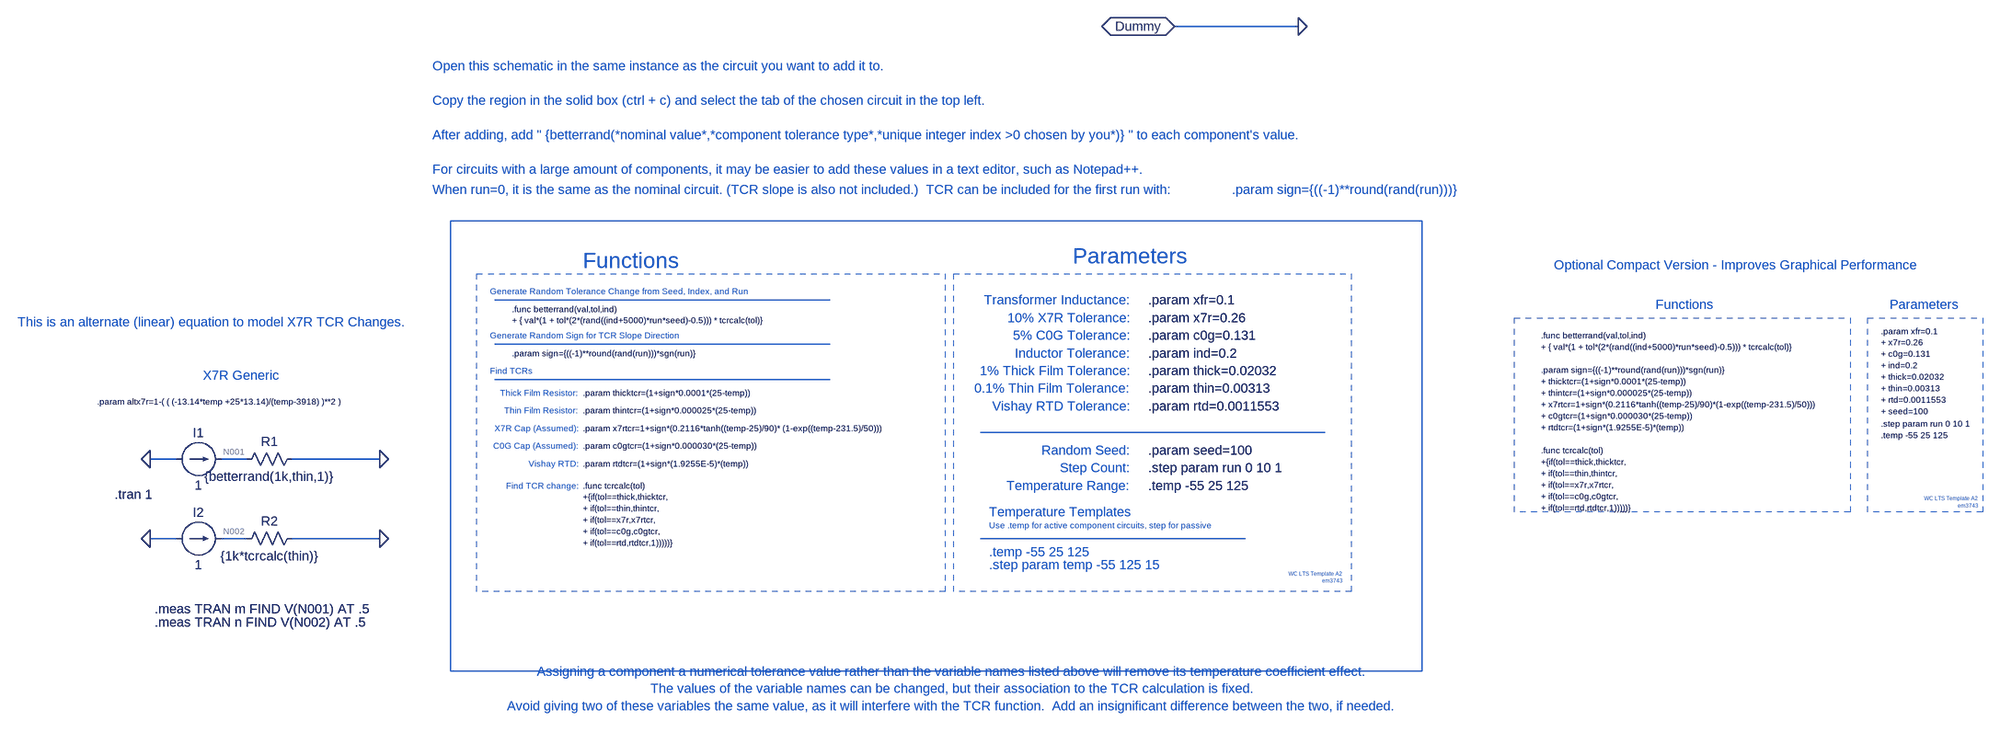
[diagram p0: schematic WCSpiceBlock_A2.asc]
WCSpiceBlock_A2.asc, the LTspice schematic file:
Version 4
SHEET 1 3364 776
WIRE 1296 -640 1072 -640
WIRE -736 144 -784 144
WIRE -608 144 -656 144
WIRE -368 144 -528 144
WIRE -736 288 -784 288
WIRE -608 288 -656 288
WIRE -368 288 -528 288
FLAG -784 144 0
FLAG -368 144 0
FLAG -784 288 0
FLAG -368 288 0
FLAG 1072 -640 Dummy
IOPIN 1072 -640 BiDir
FLAG 1296 -640 0
SYMBOL res -512 128 R90
WINDOW 0 0 56 VBottom 2
WINDOW 3 32 56 VTop 2
SYMATTR InstName R1
SYMATTR Value {betterrand(1k,thin,1)}
SYMBOL current -736 144 R270
WINDOW 0 32 40 VTop 2
WINDOW 3 -32 40 VBottom 2
WINDOW 123 0 0 Left 0
WINDOW 39 0 0 Left 0
SYMATTR InstName I1
SYMATTR Value 1
SYMBOL res -512 272 R90
WINDOW 0 0 56 VBottom 2
WINDOW 3 32 56 VTop 2
SYMATTR InstName R2
SYMATTR Value {1k*tcrcalc(thin)}
SYMBOL current -736 288 R270
WINDOW 0 32 40 VTop 2
WINDOW 3 -32 40 VBottom 2
WINDOW 123 0 0 Left 0
WINDOW 39 0 0 Left 0
SYMATTR InstName I2
SYMATTR Value 1
TEXT -848 208 Left 2 !.tran 1
TEXT -776 416 Left 2 !.meas TRAN m FIND V(N001) AT .5
TEXT -776 440 Left 2 !.meas TRAN n FIND V(N002) AT .5
TEXT 1024 -112 Left 2 !.param x7r=0.26
TEXT 1024 -16 Left 2 !.param thick=0.02032
TEXT 1024 16 Left 2 !.param thin=0.00313
TEXT -128 -128 Left 1 !.func betterrand(val,tol,ind)\n+ { val*(1 + tol*(2*(rand((ind+5000)*run*seed)-0.5))) * tcrcalc(tol)}
TEXT 1024 -144 Left 2 !.param xfr=0.1
TEXT 1024 -48 Left 2 !.param ind=0.2
TEXT 0 192 Left 1 !.func tcrcalc(tol)\n+{if(tol==thick,thicktcr, \n+ if(tol==thin,thintcr,\n+ if(tol==x7r,x7rtcr,\n+ if(tol==c0g,c0gtcr,\n+ if(tol==rtd,rtdtcr,1)))))}
TEXT 0 24 Left 1 !.param thicktcr=(1+sign*0.0001*(25-temp))
TEXT 0 56 Left 1 !.param thintcr=(1+sign*0.000025*(25-temp))
TEXT -128 -48 Left 1 !.param sign={((-1)**round(rand(run)))*sgn(run)}
TEXT 1024 160 Left 2 !.step param run 0 10 1
TEXT 1024 192 Left 2 !.temp -55 25 125
TEXT 736 264 Left 1 ;Use .temp for active component circuits, step for passive
TEXT 0 88 Left 1 !.param x7rtcr=1+sign*(0.2116*tanh((temp-25)/90)* (1-exp((temp-231.5)/50)))
TEXT -8 24 Right 1 ;Thick Film Resistor:
TEXT -8 56 Right 1 ;Thin Film Resistor:
TEXT -8 88 Right 1 ;X7R Cap (Assumed):
TEXT 992 -144 Right 2 ;Transformer Inductance:
TEXT 992 -112 Right 2 ;10% X7R Tolerance:
TEXT 992 -48 Right 2 ;Inductor Tolerance:
TEXT 992 -16 Right 2 ;1% Thick Film Tolerance:
TEXT 992 16 Right 2 ;0.1% Thin Film Tolerance:
TEXT 1024 128 Left 2 !.param seed=100
TEXT -8 192 Right 1 ;Find TCR change:
TEXT -168 -160 Left 1 ;Generate Random Tolerance Change from Seed, Index, and Run
TEXT 992 128 Right 2 ;Random Seed:
TEXT 736 240 Left 2 ;Temperature Templates
TEXT 736 312 Left 2 ;.temp -55 25 125
TEXT 736 336 Left 2 ;.step param temp -55 125 15
TEXT -168 -80 Left 1 ;Generate Random Sign for TCR Slope Direction
TEXT 992 192 Right 2 ;Temperature Range:
TEXT 992 160 Right 2 ;Step Count:
TEXT -168 -16 Left 1 ;Find TCRs
TEXT 888 -224 Left 4 ;Parameters
TEXT 0 -216 Left 4 ;Functions
TEXT 0 120 Left 1 !.param c0gtcr=(1+sign*0.000030*(25-temp))
TEXT -8 120 Right 1 ;C0G Cap (Assumed):
TEXT 1024 -80 Left 2 !.param c0g=0.131
TEXT 992 -80 Right 2 ;5% C0G Tolerance:
TEXT -688 -8 Left 2 ;X7R Generic
TEXT -880 40 Left 1 !.param altx7r=1-( ( (-13.14*temp +25*13.14)/(temp-3918) )**2 )
TEXT -1024 -104 Left 2 ;This is an alternate (linear) equation to model X7R TCR Changes.
TEXT -272 -568 Left 2 ;Open this schematic in the same instance as the circuit you want to add it to.\n \nCopy the region in the solid box (ctrl + c) and select the tab of the chosen circuit in the top left.\n \nAfter adding, add " {betterrand(*nominal value*,*component tolerance type*,*unique integer index >0 chosen by you*)} " to each component's value.\n \nFor circuits with a large amount of components, it may be easier to add these values in a text editor, such as Notepad++.
TEXT -8 152 Right 1 ;Vishay RTD:
TEXT 1024 48 Left 2 !.param rtd=0.0011553
TEXT 992 48 Right 2 ;Vishay RTD Tolerance:
TEXT 0 152 Left 1 !.param rtdtcr=(1+sign*(1.9255E-5)*(temp))
TEXT -272 -344 Left 2 ;When run=0, it is the same as the nominal circuit. (TCR slope is also not included.)  TCR can be included for the first run with:
TEXT 1176 -344 Left 2 ;.param sign={((-1)**round(rand(run)))}
TEXT 1824 -80 Left 1 !.func betterrand(val,tol,ind)\n+ { val*(1 + tol*(2*(rand((ind+5000)*run*seed)-0.5))) * tcrcalc(tol)}\n \n.param sign={((-1)**round(rand(run)))*sgn(run)}\n+ thicktcr=(1+sign*0.0001*(25-temp))\n+ thintcr=(1+sign*0.000025*(25-temp))\n+ x7rtcr=1+sign*(0.2116*tanh((temp-25)/90)*(1-exp((temp-231.5)/50)))\n+ c0gtcr=(1+sign*0.000030*(25-temp))\n+ rtdtcr=(1+sign*(1.9255E-5)*(temp))\n \n.func tcrcalc(tol)\n+{if(tol==thick,thicktcr, \n+ if(tol==thin,thintcr,\n+ if(tol==x7r,x7rtcr,\n+ if(tol==c0g,c0gtcr,\n+ if(tol==rtd,rtdtcr,1)))))}
TEXT 2440 -88 Left 1 !.param xfr=0.1\n+ x7r=0.26\n+ c0g=0.131\n+ ind=0.2\n+ thick=0.02032\n+ thin=0.00313\n+ rtd=0.0011553\n+ seed=100
TEXT 2440 80 Left 1 !.step param run 0 10 1\n.temp -55 25 125
TEXT 2456 -136 Left 2 ;Parameters
TEXT 2032 -136 Left 2 ;Functions
TEXT 1848 -208 Left 2 ;Optional Compact Version - Improves Graphical Performance
TEXT 672 560 Center 2 ;Assigning a component a numerical tolerance value rather than the variable names listed above will remove its temperature coefficient effect.\nThe values of the variable names can be changed, but their association to the TCR calculation is fixed.\nAvoid giving two of these variables the same value, as it will interfere with the TCR function.  Add an insignificant difference between the two, if needed.
TEXT 2616 216 Right 0 ;WC LTS Template A2\nem3743
TEXT 1376 352 Right 0 ;WC LTS Template A2\nem3743
LINE Normal 1344 96 720 96
LINE Normal 1200 288 720 288
LINE Normal 448 -144 -160 -144
LINE Normal 448 -64 -160 -64
LINE Normal 448 0 -160 0
RECTANGLE Normal 656 384 -192 -192 2
RECTANGLE Normal 1392 384 672 -192 2
RECTANGLE Normal 1520 528 -240 -288
RECTANGLE Normal 2384 240 1776 -112 2
RECTANGLE Normal 2624 240 2416 -112 2

The netlist it stands for:
* WCSpiceBlock_A2.asc
R1 0 N001 {betterrand(1k,thin,1)}
I1 0 N001 1
R2 0 N002 {1k*tcrcalc(thin)}
I2 0 N002 1
.tran 1
.meas TRAN m FIND V(N001) AT .5
.meas TRAN n FIND V(N002) AT .5
.param x7r=0.26
.param thick=0.02032
.param thin=0.00313
.func betterrand(val,tol,ind)
+ { val*(1 + tol*(2*(rand((ind+5000)*run*seed)-0.5))) * tcrcalc(tol)}
.param xfr=0.1
.param ind=0.2
.func tcrcalc(tol)
+{if(tol==thick,thicktcr,
+ if(tol==thin,thintcr,
+ if(tol==x7r,x7rtcr,
+ if(tol==c0g,c0gtcr,
+ if(tol==rtd,rtdtcr,1)))))}
.param thicktcr=(1+sign*0.0001*(25-temp))
.param thintcr=(1+sign*0.000025*(25-temp))
.param sign={((-1)**round(rand(run)))*sgn(run)}
.step param run 0 10 1
.temp -55 25 125
* Use .temp for active component circuits, step for passive
.param x7rtcr=1+sign*(0.2116*tanh((temp-25)/90)* (1-exp((temp-231.5)/50)))
* Thick Film Resistor:
* Thin Film Resistor:
* X7R Cap (Assumed):
* Transformer Inductance:
* 10% X7R Tolerance:
* Inductor Tolerance:
* 1% Thick Film Tolerance:
* 0.1% Thin Film Tolerance:
.param seed=100
* Find TCR change:
* Generate Random Tolerance Change from Seed, Index, and Run
* Random Seed:
* Temperature Templates
* .temp -55 25 125
* .step param temp -55 125 15
* Generate Random Sign for TCR Slope Direction
* Temperature Range:
* Step Count:
* Find TCRs
* Parameters
* Functions
.param c0gtcr=(1+sign*0.000030*(25-temp))
* C0G Cap (Assumed):
.param c0g=0.131
* 5% C0G Tolerance:
* X7R Generic
.param altx7r=1-( ( (-13.14*temp +25*13.14)/(temp-3918) )**2 )
* This is an alternate (linear) equation to model X7R TCR Changes.
* Open this schematic in the same instance as the circuit you want to add it to.
* Copy the region in the solid box (ctrl + c) and select the tab of the chosen circuit in the top left.
* After adding, add " {betterrand(*nominal value*,*component tolerance type*,*unique integer index >0 chosen by you*)} " to each component's value.
* For circuits with a large amount of components, it may be easier to add these values in a text editor, such as Notepad++.
* Vishay RTD:
.param rtd=0.0011553
* Vishay RTD Tolerance:
.param rtdtcr=(1+sign*(1.9255E-5)*(temp))
* When run=0, it is the same as the nominal circuit. (TCR slope is also not included.)  TCR can be included for the first run with:
* .param sign={((-1)**round(rand(run)))}
.func betterrand(val,tol,ind)
+ { val*(1 + tol*(2*(rand((ind+5000)*run*seed)-0.5))) * tcrcalc(tol)}
.param sign={((-1)**round(rand(run)))*sgn(run)}
+ thicktcr=(1+sign*0.0001*(25-temp))
+ thintcr=(1+sign*0.000025*(25-temp))
+ x7rtcr=1+sign*(0.2116*tanh((temp-25)/90)*(1-exp((temp-231.5)/50)))
+ c0gtcr=(1+sign*0.000030*(25-temp))
+ rtdtcr=(1+sign*(1.9255E-5)*(temp))
.func tcrcalc(tol)
+{if(tol==thick,thicktcr,
+ if(tol==thin,thintcr,
+ if(tol==x7r,x7rtcr,
+ if(tol==c0g,c0gtcr,
+ if(tol==rtd,rtdtcr,1)))))}
.param xfr=0.1
+ x7r=0.26
+ c0g=0.131
+ ind=0.2
+ thick=0.02032
+ thin=0.00313
+ rtd=0.0011553
+ seed=100
.step param run 0 10 1
.temp -55 25 125
* Parameters
* Functions
* Optional Compact Version - Improves Graphical Performance
* Assigning a component a numerical tolerance value rather than the variable names listed above will remove its temperature coefficient effect.
* The values of the variable names can be changed, but their association to the TCR calculation is fixed.
* Avoid giving two of these variables the same value, as it will interfere with the TCR function.  Add an insignificant difference between the two, if needed.
* WC LTS Template A2
* em3743
* WC LTS Template A2
* em3743
.backanno
.end